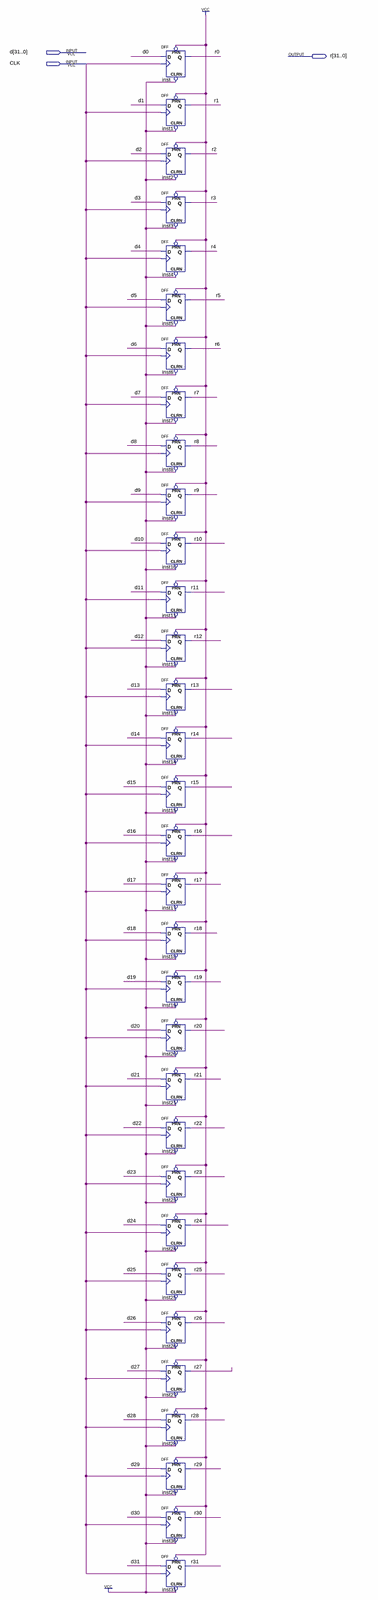
[diagram p0: schematic sheet, whole]
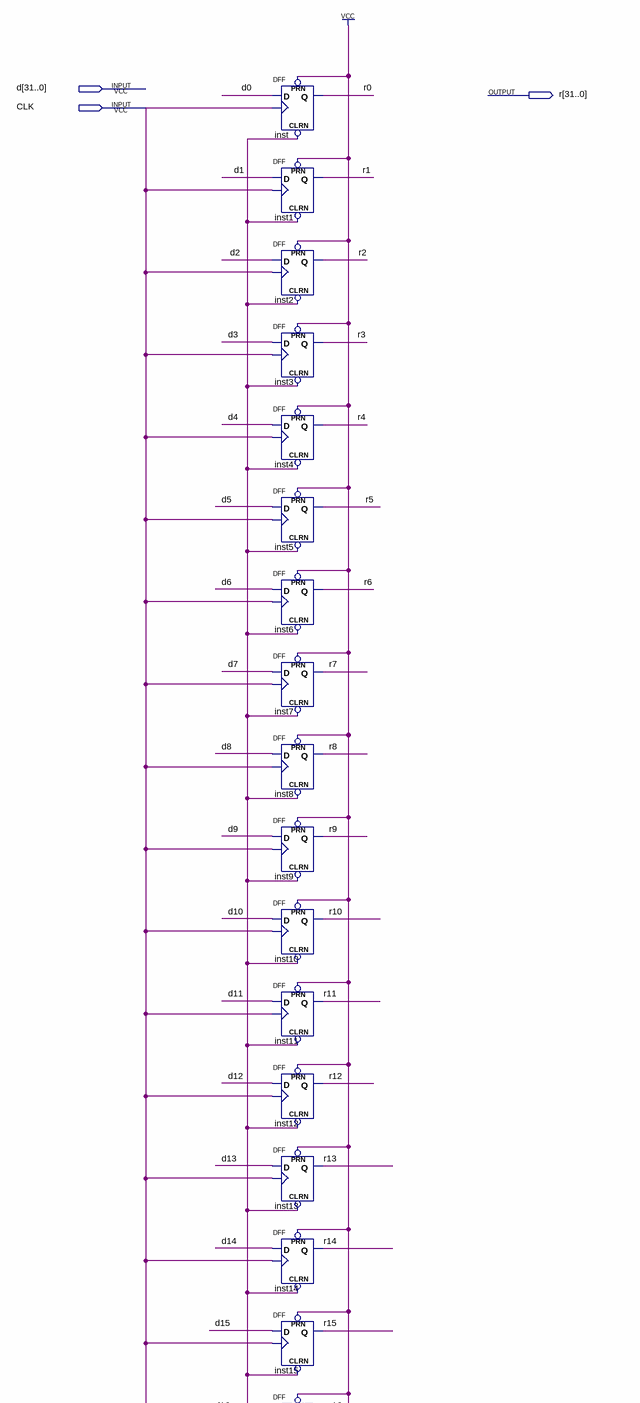
[diagram p1: schematic sheet, upper part]
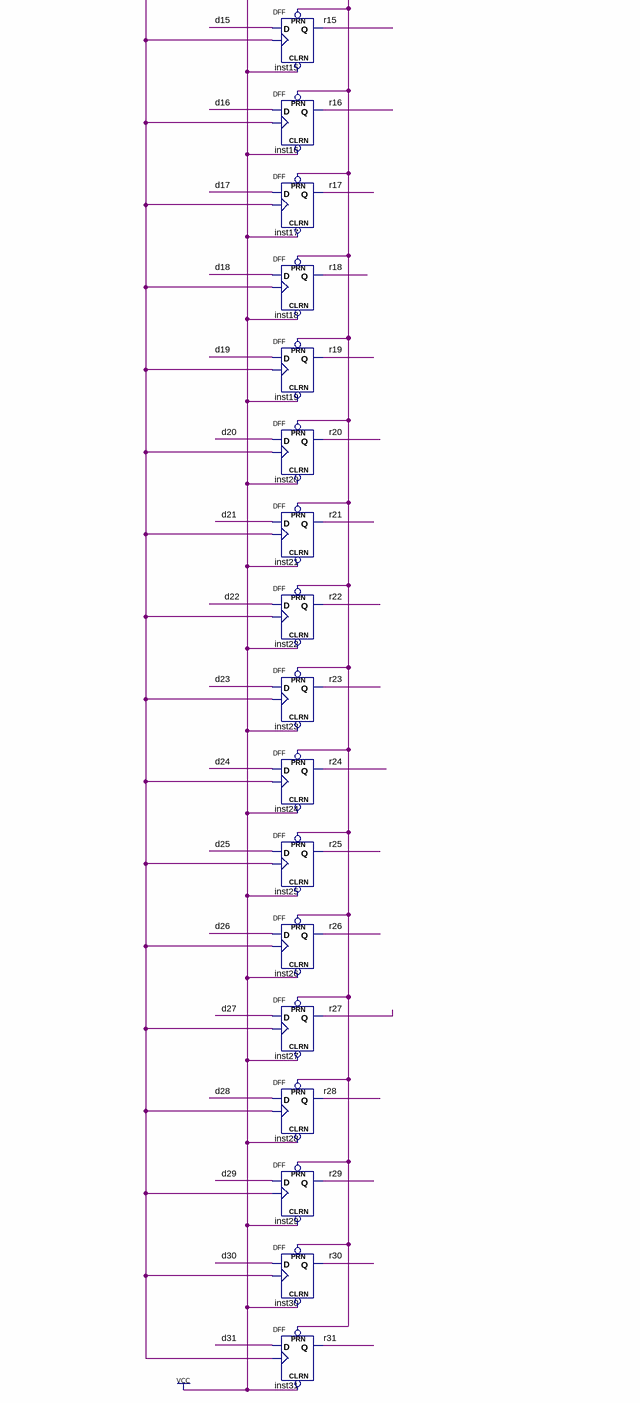
[diagram p2: schematic sheet, lower part]
// Quartus schematic 32_reg.bdf as structural Verilog: 32 symbols, 3 pins
module \32_reg  (
  input  [31:0] d,
  input  CLK,
  output [31:0] r
);

  DFF inst (.CLRN(1'b1), .CLK(CLK), .D(d[0]), .PRN(1'b1), .Q(r[0]));
  DFF inst1 (.CLRN(1'b1), .CLK(CLK), .D(d[1]), .PRN(1'b1), .Q(r[1]));
  DFF inst2 (.CLRN(1'b1), .CLK(CLK), .D(d[2]), .PRN(1'b1), .Q(r[2]));
  DFF inst3 (.CLRN(1'b1), .CLK(CLK), .D(d[3]), .PRN(1'b1), .Q(r[3]));
  DFF inst4 (.CLRN(1'b1), .CLK(CLK), .D(d[4]), .PRN(1'b1), .Q(r[4]));
  DFF inst5 (.CLRN(1'b1), .CLK(CLK), .D(d[5]), .PRN(1'b1), .Q(r[5]));
  DFF inst6 (.CLRN(1'b1), .CLK(CLK), .D(d[6]), .PRN(1'b1), .Q(r[6]));
  DFF inst7 (.CLRN(1'b1), .CLK(CLK), .D(d[7]), .PRN(1'b1), .Q(r[7]));
  DFF inst8 (.CLRN(1'b1), .CLK(CLK), .D(d[8]), .PRN(1'b1), .Q(r[8]));
  DFF inst9 (.CLRN(1'b1), .CLK(CLK), .D(d[9]), .PRN(1'b1), .Q(r[9]));
  DFF inst10 (.CLRN(1'b1), .CLK(CLK), .D(d[10]), .PRN(1'b1), .Q(r[10]));
  DFF inst11 (.CLRN(1'b1), .CLK(CLK), .D(d[11]), .PRN(1'b1), .Q(r[11]));
  DFF inst12 (.CLRN(1'b1), .CLK(CLK), .D(d[12]), .PRN(1'b1), .Q(r[12]));
  DFF inst13 (.CLRN(1'b1), .CLK(CLK), .D(d[13]), .PRN(1'b1), .Q(r[13]));
  DFF inst14 (.CLRN(1'b1), .CLK(CLK), .D(d[14]), .PRN(1'b1), .Q(r[14]));
  DFF inst15 (.CLRN(1'b1), .CLK(CLK), .D(d[15]), .PRN(1'b1), .Q(r[15]));
  DFF inst16 (.CLRN(1'b1), .CLK(CLK), .D(d[16]), .PRN(1'b1), .Q(r[16]));
  DFF inst17 (.CLRN(1'b1), .CLK(CLK), .D(d[17]), .PRN(1'b1), .Q(r[17]));
  DFF inst18 (.CLRN(1'b1), .CLK(CLK), .D(d[18]), .PRN(1'b1), .Q(r[18]));
  DFF inst19 (.CLRN(1'b1), .CLK(CLK), .D(d[19]), .PRN(1'b1), .Q(r[19]));
  DFF inst20 (.CLRN(1'b1), .CLK(CLK), .D(d[20]), .PRN(1'b1), .Q(r[20]));
  DFF inst21 (.CLRN(1'b1), .CLK(CLK), .D(d[21]), .PRN(1'b1), .Q(r[21]));
  DFF inst22 (.CLRN(1'b1), .CLK(CLK), .D(d[22]), .PRN(1'b1), .Q(r[22]));
  DFF inst23 (.CLRN(1'b1), .CLK(CLK), .D(d[23]), .PRN(1'b1), .Q(r[23]));
  DFF inst24 (.CLRN(1'b1), .CLK(CLK), .D(d[24]), .PRN(1'b1), .Q(r[24]));
  DFF inst25 (.CLRN(1'b1), .CLK(CLK), .D(d[25]), .PRN(1'b1), .Q(r[25]));
  DFF inst26 (.CLRN(1'b1), .CLK(CLK), .D(d[26]), .PRN(1'b1), .Q(r[26]));
  DFF inst27 (.CLRN(1'b1), .CLK(CLK), .D(d[27]), .PRN(1'b1), .Q(r[27]));
  DFF inst28 (.CLRN(1'b1), .CLK(CLK), .D(d[28]), .PRN(1'b1), .Q(r[28]));
  DFF inst29 (.CLRN(1'b1), .CLK(CLK), .D(d[29]), .PRN(1'b1), .Q(r[29]));
  DFF inst30 (.CLRN(1'b1), .CLK(CLK), .D(d[30]), .PRN(1'b1), .Q(r[30]));
  DFF inst31 (.CLRN(1'b1), .CLK(CLK), .D(d[31]), .PRN(1'b1), .Q(r[31]));
endmodule
